# Altium schematic sheet Đề 09.SchDoc
size A3; SheetNumber: 1; SheetTotal: 1; SPICEModelCacheTZUUTMWZ: <root> / <DocumentId>TZUUTMWZ</DocumentId> / <CacheFrame Number="0"> / <Model Name="fuse" Kind="CKT"> / <Text>.SUBCKT FUSE 1 2 PARAMS: CURRENT=1 RESISTANCE=1m / SW1 1 2 3 0 SMOD OFF / BNLV 3 0 V=(abs(v(1,2))) / .MODEL SMOD SW (VT={(CURRENT*RESISTANCE)} RON=1g ROFF={RESISTANCE}) / .ENDS FUSE</Text> / </Model> / <Model Name="diode" Kind="MDL"> / <Text>*Default Diode / *Diode Pinout: A,K / .MODEL DIODE D()</Text> / </Model> / <Model Name="irf1010" Kind="CKT"> / <Text>*IRF1010 MCE 4-2-96 / *55V  75A .014 ohm HEXFET pkg:TO-220 2,1,3 / .SUBCKT IRF1010  10 20 40 40 / M1   1  2  3  3  DMOS L=1U W=1U / RD  10  1  5.65M / RS  30  3  1.35M / RG  20  2  12.1 / CGS  2  3  2.15N / EGD 12  0  2  1  1 / VFB 14  0  0 / FFB  2  1  VFB  1 / CGD 13 14  4.49N / R1  13  0  1 / D1  12 13  DLIM / DDG 15 14  DCGD / R2  12 15  1 / D2  15  0  DLIM / DSD  3 10  DSUB / LS  30 40  7.5N / .MODEL DMOS NMOS (LEVEL=3 THETA=60M VMAX=114K ETA=2M VTO=3 KP=19.4) / .MODEL DCGD D (CJO=4.49N VJ=.6 M=.68) / .MODEL DSUB D (IS=311N N=1.5 RS=8.67M BV=55 CJO=4.08N VJ=.8 M=.42 TT=100N) / .MODEL DLIM D (IS=100U) / .ENDS IRF1010</Text> / </Model> / </CacheFrame> / </root>
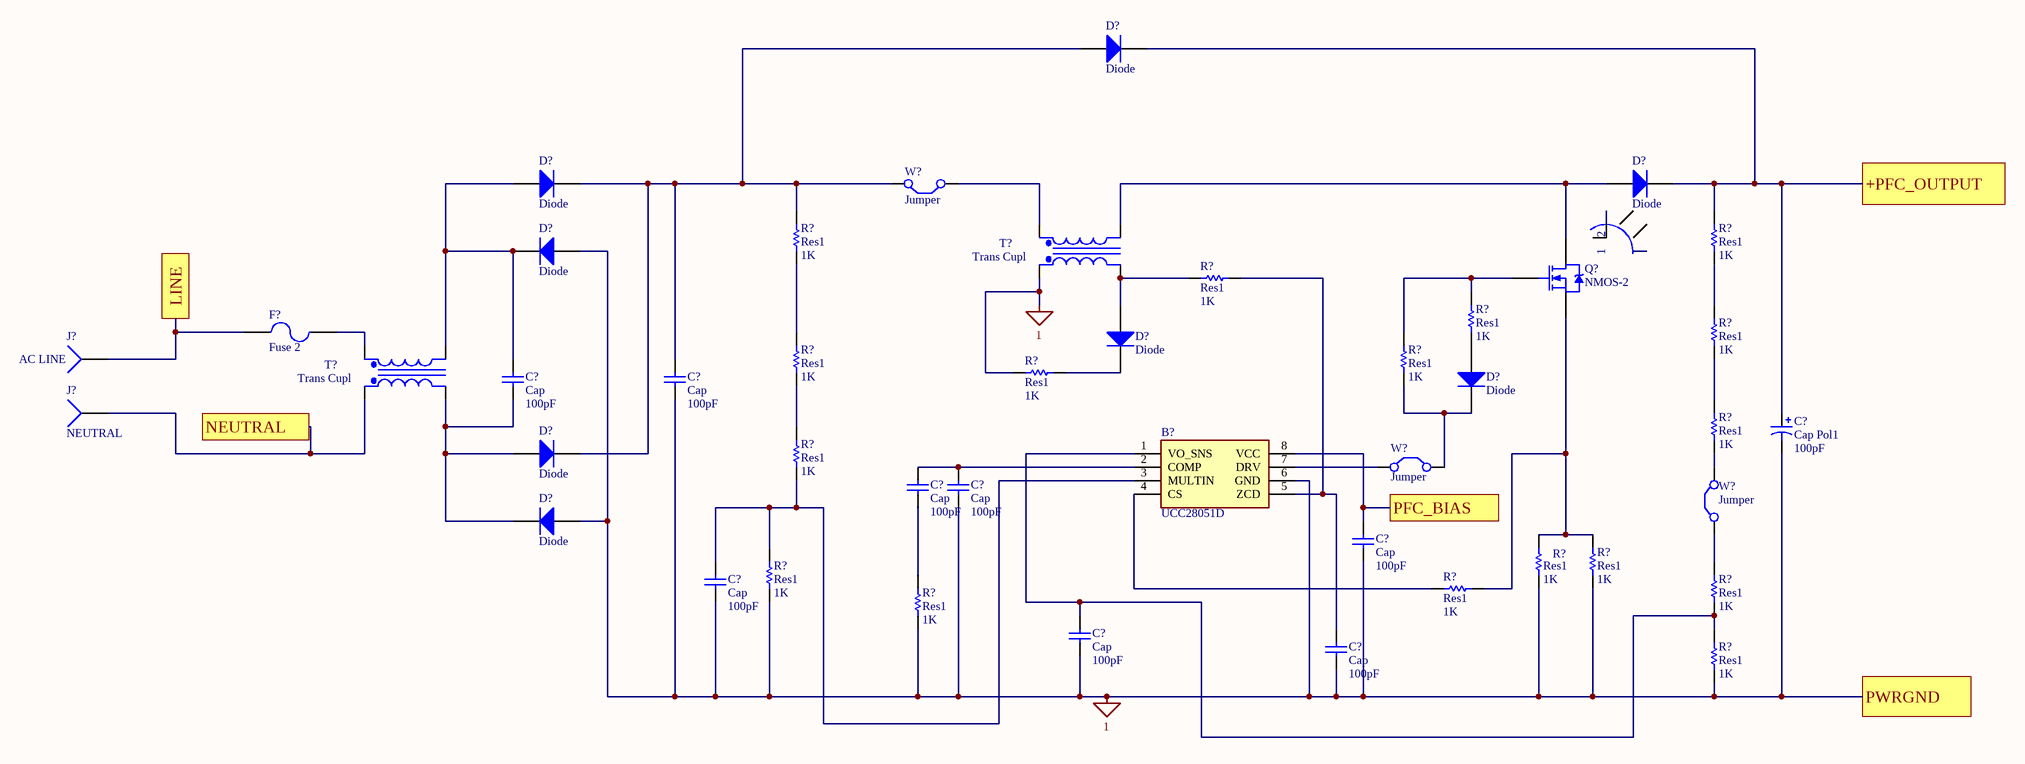
[diagram p0: Đề 09.SchDoc]

## Parts
(Parts that share a designator on the sheet are numbered #1, #2 ... from top to bottom, then left to right.)
B?  UCC28051D  [SOIC127P600X175-8N]
C?#1  Cap  value 100pF  [RAD-0.3]
C?#2  Cap  value 100pF  [RAD-0.3]
C?#3  Cap Pol1  value 100pF  [RB7.6-15]
C?#4  Cap  value 100pF  [RAD-0.3]
C?#5  Cap  value 100pF  [RAD-0.3]
C?#6  Cap  value 100pF  [RAD-0.3]
C?#7  Cap  value 100pF  [RAD-0.3]
C?#8  Cap  value 100pF  [RAD-0.3]
C?#9  Cap  value 100pF  [RAD-0.3]
D?#1  Diode  [SMC]
D?#2  Diode  [SMC]
D?#3  Diode  [SMC]
D?#4  Diode  [SMC]
D?#5  Diode  [SMC]
D?#6  Diode  [SMC]
D?#7  Diode  [SMC]
D?#8  Diode  [SMC]
F?  Fuse 2  [PIN-W2/E2.8]
J?#1  AC LINE  [PIN1]
J?#2  NEUTRAL  [PIN1]
Q?  NMOS-2  [TO-220AB]
R?#1  Res1  value 1K  [AXIAL-0.3]
R?#2  Res1  value 1K  [AXIAL-0.3]
R?#3  Res1  value 1K  [AXIAL-0.3]
R?#4  Res1  value 1K  [AXIAL-0.3]
R?#5  Res1  value 1K  [AXIAL-0.3]
R?#6  Res1  value 1K  [AXIAL-0.3]
R?#7  Res1  value 1K  [AXIAL-0.3]
R?#8  Res1  value 1K  [AXIAL-0.3]
R?#9  Res1  value 1K  [AXIAL-0.3]
R?#10  Res1  value 1K  [AXIAL-0.3]
R?#11  Res1  value 1K  [AXIAL-0.3]
R?#12  Res1  value 1K  [AXIAL-0.3]
R?#13  Res1  value 1K  [AXIAL-0.3]
R?#14  Res1  value 1K  [AXIAL-0.3]
R?#15  Res1  value 1K  [AXIAL-0.3]
R?#16  Res1  value 1K  [AXIAL-0.3]
R?#17  Res1  value 1K  [AXIAL-0.3]
T?#1  Trans Cupl  [TRF_4]
T?#2  Trans Cupl  [TRF_4]
W?#1  Jumper  [RAD-0.2]
W?#2  Jumper  [RAD-0.2]
W?#3  Jumper  [RAD-0.2]

## Ports
+PFC_OUTPUT, LINE, NEUTRAL, PFC_BIAS, PWRGND

## Nets
1: B?.6(GND) C?#2.2 C?#3.2 C?#5.2 C?#6.1 C?#7.2 C?#8.1 C?#9.1 D?#4.1(A) D?#8.1(A) R?#6.1 R?#12.1 R?#13.1 R?#14.1 R?#16.1 R?#17.1 T?#1.1(Pri+) ; port PWRGND
+PFC_OUTPUT: C?#3.1 D?#1.2(K) D?#3.2(K) R?#2.2 ; port +PFC_OUTPUT
LINE: F?.1 J?#1.1 ; port LINE
NEUTRAL: J?#2.1 T?#2.1(Pri+) ; port NEUTRAL
PFC_BIAS: B?.8(VCC) C?#6.2 ; port PFC_BIAS
NetB?_1: B?.1(VO_SNS) C?#8.2 R?#15.1 R?#17.2
NetB?_2: B?.2(COMP) C?#4.1 C?#5.1
NetB?_3: B?.3(MULTIN) C?#7.1 R?#10.1 R?#14.2
NetB?_4: B?.4(CS) R?#11.1
NetB?_5: B?.5(ZCD) C?#9.2 R?#3.2
NetB?_7: B?.7(DRV) W?#2.1(C1)
NetC?#1_1: C?#1.1 D?#2.1(A) D?#4.2(K) T?#2.4(Sec-)
NetC?#1_2: C?#1.2 D?#7.1(A) D?#8.2(K) T?#2.2(Pri-)
NetC?#2_1: C?#2.1 D?#1.1(A) D?#2.2(K) D?#7.2(K) R?#1.2 W?#1.2(C2)
NetC?#4_2: C?#4.2 R?#16.2
NetD?#3_1: D?#3.1(A) Q?.2(D) T?#1.4(Sec-)
NetD?#5_1: D?#5.1(A) R?#3.1 T?#1.2(Pri-)
NetD?#5_2: D?#5.2(K) R?#6.2
NetD?#6_1: D?#6.1(A) R?#4.1
NetD?#6_2: D?#6.2(K) R?#8.1 W?#2.2(C2)
NetF?_2: F?.2 T?#2.3(Sec+)
NetQ?_1: Q?.1(G) R?#4.2 R?#8.2
NetQ?_3: Q?.3(S) R?#11.2 R?#12.2 R?#13.2
NetR?#1_1: R?#1.1 R?#7.2
NetR?#2_1: R?#2.1 R?#5.2
NetR?#5_1: R?#5.1 R?#9.2
NetR?#7_1: R?#7.1 R?#10.2
NetR?#9_1: R?#9.1 W?#3.2(C2)
NetR?#15_2: R?#15.2 W?#3.1(C1)
NetT?#1_3: T?#1.3(Sec+) W?#1.1(C1)

## Notes on the sheet
- (near Q?) 1
- 2

## Library data of the parts
B? = UCC28051D: PFC Controller for low to medium power applications requiring compliance with IEC 61000-3-2; Manufacturer_Name: Texas Instruments; Geometry.Height: 1.75mm; Manufacturer_Part_Number: UCC28051D; Mouser Part Number: 595-UCC28051D; Mouser Price/Stock: https://www.mouser.co.uk/ProductDetail/Texas-Instruments/UCC28051D?qs=eJkN62t4xTU4YSDaEo89xg%3D%3D; Arrow Part Number: UCC28051D; Arrow Price/Stock: https://www.arrow.com/en/products/ucc28051d/texas-instruments; Datasheet Link: http://www.ti.com/lit/gpn/ucc28051
C?#1 C?#2 C?#4-C?#9 = Cap: Capacitor; Published: 8-Jun-2000; LatestRevisionDate: 17-Jul-2002; LatestRevisionNote: Re-released for DXP Platform.; PackageReference: RAD-0.3; Publisher: Altium Limited; PackageDescription: Radial Cap, Thru-Hole; 2 Leads; 0.3 in Pin Spacing
C?#3 = Cap Pol1: Polarized Capacitor (Radial); Published: 8-Jun-2000; LatestRevisionDate: 17-Jul-2002; LatestRevisionNote: Re-released for DXP Platform.; PackageReference: RB7.6-15; Publisher: Altium Limited; PackageDescription: Polarized Capacitor (Radial); 2 Leads
D?#1-D?#8 = Diode: Default Diode; Published: 8-Jun-2000; LatestRevisionDate: 17-Jul-2002; LatestRevisionNote: Re-released for DXP Platform.; PackageVersion: Sep-1996; PackageReference: SMC; Publisher: Altium Limited; PackageDescription: DO-214-AB/SMC; 2 C-Bend Leads; Body 7.9 x 5.9 mm, inc. leads (LxW); Code_JEDEC: DO-214-AB
F? = Fuse 2: Fuse; Published: 8-Jun-2000; LatestRevisionDate: 17-Jul-2002; LatestRevisionNote: Re-released for DXP Platform.; PackageReference: PIN-W2/E2.8; Publisher: Altium Limited; PackageDescription: Thru-Hole; 2 Leads
J?#1 J?#2 = Socket: LatestRevisionDate: 17-Jul-2002; LatestRevisionNote: Re-released for DXP Platform.; Publisher: Altium Limited
Q? = NMOS-2: N-Channel Power MOSFET; Note: Pin 2 is electrically connected to pin 4.; Published: 8-Jun-2000; LatestRevisionDate: 17-Jul-2002; LatestRevisionNote: Re-released for DXP Platform.; DatasheetVersion: PD-9.814; PackageVersion: Feb-1997; PackageReference: TO-220AB; Publisher: Altium Limited; PackageDescription: TO, Thru-Hole, Vertical, Heatsink Mounted; 3 In-Line Leads; Pitch 2.54 mm; ComponentLink1Description: Manufacturer Link; ComponentLink1URL: http://www.irf.com/
R?#1-R?#17 = Res1: Resistor; Published: 8-Jun-2000; LatestRevisionDate: 17-Jul-2002; LatestRevisionNote: Re-released for DXP Platform.; PackageReference: AXIAL-0.3; Publisher: Altium Limited; PackageDescription: Axial Device, Thru-Hole; 2 Leads; 0.3 in Pin Spacing
T?#1 T?#2 = Trans Cupl: Transformer (Coupled Inductor Model); Published: 8-Jun-2000; LatestRevisionDate: 17-Jul-2002; LatestRevisionNote: Re-released for DXP Platform.; PackageReference: TRF_4; Publisher: Altium Limited; PackageDescription: Transformer; 4 Leads
W?#1-W?#3 = Jumper: Jumper Wire; Published: 24-Mar-1999; LatestRevisionDate: 17-Jul-2002; LatestRevisionNote: Re-released for DXP Platform.; PackageReference: RAD-0.2; Publisher: Altium Limited; PackageDescription: Radial Cap, Thru-Hole; 2 Leads; 0.2 in Pin Spacing